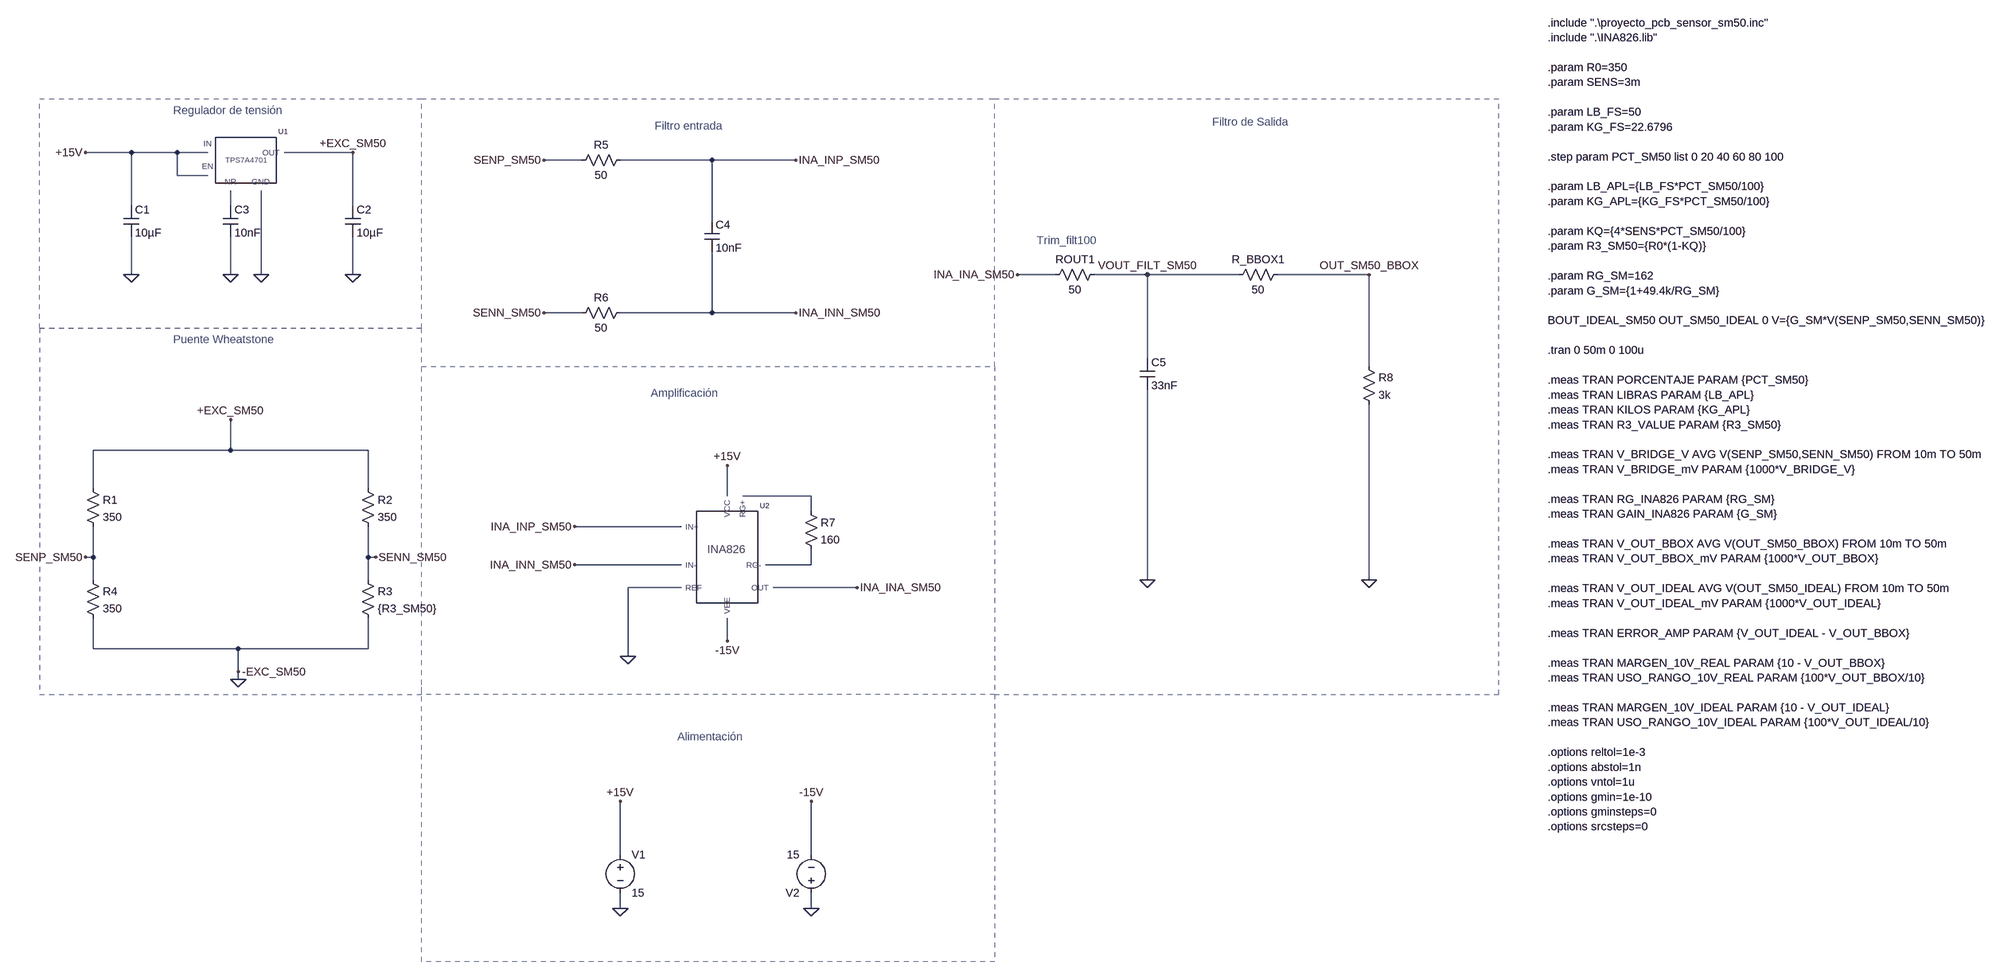
[diagram p0: schematic sensor_SM50.asc]
sensor_SM50.asc, the LTspice schematic file:
Version 4.1
SHEET 1 2144 3804
WIRE -2576 -384 -2672 -384
WIRE -2480 -384 -2576 -384
WIRE -2416 -384 -2480 -384
WIRE -2112 -384 -2256 -384
WIRE -1632 -368 -1712 -368
WIRE -1360 -368 -1552 -368
WIRE -1184 -368 -1360 -368
WIRE -2480 -336 -2480 -384
WIRE -2416 -336 -2480 -336
WIRE -2576 -272 -2576 -384
WIRE -2368 -272 -2368 -304
WIRE -2112 -272 -2112 -384
WIRE -1360 -240 -1360 -368
WIRE -2576 -128 -2576 -208
WIRE -2368 -128 -2368 -208
WIRE -2304 -128 -2304 -304
WIRE -2112 -128 -2112 -208
WIRE -640 -128 -720 -128
WIRE -448 -128 -560 -128
WIRE -256 -128 -448 -128
WIRE 16 -128 -176 -128
WIRE -1632 -48 -1712 -48
WIRE -1360 -48 -1360 -176
WIRE -1360 -48 -1552 -48
WIRE -1184 -48 -1360 -48
WIRE -448 48 -448 -128
WIRE 16 64 16 -128
WIRE -2368 240 -2368 176
WIRE -2368 240 -2656 240
WIRE -2080 240 -2368 240
WIRE -2656 320 -2656 240
WIRE -2080 320 -2080 240
WIRE -1328 336 -1328 272
WIRE -1152 336 -1296 336
WIRE -1152 368 -1152 336
WIRE -1424 400 -1648 400
WIRE -2656 464 -2656 400
WIRE -2656 464 -2672 464
WIRE -2080 464 -2080 400
WIRE -2064 464 -2080 464
WIRE -1424 480 -1648 480
WIRE -1152 480 -1152 448
WIRE -1152 480 -1248 480
WIRE -2656 512 -2656 464
WIRE -2080 512 -2080 464
WIRE -448 512 -448 112
WIRE 16 512 16 144
WIRE -1424 528 -1536 528
WIRE -1056 528 -1232 528
WIRE -1328 640 -1328 592
WIRE -2656 656 -2656 592
WIRE -2352 656 -2656 656
WIRE -2080 656 -2080 592
WIRE -2080 656 -2352 656
WIRE -1536 672 -1536 528
WIRE -2352 704 -2352 656
WIRE -2352 720 -2352 704
WIRE -1552 1088 -1552 976
WIRE -1152 1088 -1152 976
WIRE -1552 1200 -1552 1168
WIRE -1152 1200 -1152 1168
FLAG -1152 1200 0
FLAG -1552 1200 0
FLAG -1552 976 +15V
FLAG -1152 976 -15V
FLAG -2672 -384 +15V
FLAG -2576 -128 0
FLAG -2112 -128 0
FLAG -2304 -128 0
FLAG -2368 -128 0
FLAG -2112 -384 +EXC_SM50
FLAG -2368 176 +EXC_SM50
FLAG -2352 720 0
FLAG -2672 464 SENP_SM50
FLAG -2064 464 SENN_SM50
FLAG -2352 704 -EXC_SM50
FLAG -1712 -48 SENN_SM50
FLAG -1712 -368 SENP_SM50
FLAG -1184 -368 INA_INP_SM50
FLAG -1184 -48 INA_INN_SM50
FLAG -1328 640 -15V
FLAG -1328 272 +15V
FLAG -1056 528 INA_INA_SM50
FLAG -1536 672 0
FLAG -1648 480 INA_INN_SM50
FLAG -1648 400 INA_INP_SM50
FLAG -448 -128 VOUT_FILT_SM50
FLAG -448 512 0
FLAG 16 -128 OUT_SM50_BBOX
FLAG 16 512 0
FLAG -720 -128 INA_INA_SM50
SYMBOL voltage -1552 1072 R0
WINDOW 123 0 0 Left 0
SYMATTR InstName V1
SYMATTR Value 15
SYMATTR SpiceLine Rser=0.05
SYMBOL voltage -1152 1184 R180
WINDOW 123 0 0 Left 0
SYMATTR InstName V2
SYMATTR Value 15
SYMATTR SpiceLine Rser=0.05
SYMBOL cap -2592 -272 R0
SYMATTR InstName C1
SYMATTR Value 10µF
SYMBOL cap -2128 -272 R0
SYMATTR InstName C2
SYMATTR Value 10µF
SYMBOL TPS7A4701_10V -2336 -368 R0
SYMATTR InstName U1
SYMBOL cap -2384 -272 R0
SYMATTR InstName C3
SYMATTR Value 10nF
SYMBOL res -2672 304 R0
SYMATTR InstName R1
SYMATTR Value 350
SYMBOL res -2096 304 R0
SYMATTR InstName R2
SYMATTR Value 350
SYMBOL res -2096 496 R0
SYMATTR InstName R3
SYMATTR Value {R3_SM50}
SYMBOL res -2672 496 R0
SYMATTR InstName R4
SYMATTR Value 350
SYMBOL res -1536 -384 R90
WINDOW 0 0 56 VBottom 2
WINDOW 3 32 56 VTop 2
SYMATTR InstName R5
SYMATTR Value 50
SYMBOL res -1536 -64 R90
WINDOW 0 0 56 VBottom 2
WINDOW 3 32 56 VTop 2
SYMATTR InstName R6
SYMATTR Value 50
SYMBOL cap -1376 -240 R0
SYMATTR InstName C4
SYMATTR Value 10nF
SYMBOL res -1168 352 R0
SYMATTR InstName R7
SYMATTR Value 160
SYMBOL res -544 -144 R90
WINDOW 0 0 56 VBottom 2
WINDOW 3 32 56 VTop 2
SYMATTR InstName ROUT1
SYMATTR Value 50
SYMBOL cap -464 48 R0
SYMATTR InstName C5
SYMATTR Value 33nF
SYMBOL res -160 -144 R90
WINDOW 0 0 56 VBottom 2
WINDOW 3 32 56 VTop 2
SYMATTR InstName R_BBOX1
SYMATTR Value 50
SYMBOL res 0 48 R0
SYMATTR InstName R8
SYMATTR Value 3k
SYMBOL INA826 -1328 464 R0
SYMATTR InstName U2
TEXT 1192 -656 Left 2 !.include ".\\proyecto_pcb_sensor_sm50.inc"\n.include ".\\INA826.lib"\n \n.param R0=350\n.param SENS=3m\n \n.param LB_FS=50\n.param KG_FS=22.6796\n \n.step param PCT_SM50 list 0 20 40 60 80 100\n \n.param LB_APL={LB_FS*PCT_SM50/100}\n.param KG_APL={KG_FS*PCT_SM50/100}\n \n.param KQ={4*SENS*PCT_SM50/100}\n.param R3_SM50={R0*(1-KQ)}\n \n.param RG_SM=162\n.param G_SM={1+49.4k/RG_SM}\n \nBOUT_IDEAL_SM50 OUT_SM50_IDEAL 0 V={G_SM*V(SENP_SM50,SENN_SM50)}\n \n.tran 0 50m 0 100u\n \n.meas TRAN PORCENTAJE PARAM {PCT_SM50}\n.meas TRAN LIBRAS PARAM {LB_APL}\n.meas TRAN KILOS PARAM {KG_APL}\n.meas TRAN R3_VALUE PARAM {R3_SM50}\n \n.meas TRAN V_BRIDGE_V AVG V(SENP_SM50,SENN_SM50) FROM 10m TO 50m\n.meas TRAN V_BRIDGE_mV PARAM {1000*V_BRIDGE_V}\n \n.meas TRAN RG_INA826 PARAM {RG_SM}\n.meas TRAN GAIN_INA826 PARAM {G_SM}\n \n.meas TRAN V_OUT_BBOX AVG V(OUT_SM50_BBOX) FROM 10m TO 50m\n.meas TRAN V_OUT_BBOX_mV PARAM {1000*V_OUT_BBOX}\n \n.meas TRAN V_OUT_IDEAL AVG V(OUT_SM50_IDEAL) FROM 10m TO 50m\n.meas TRAN V_OUT_IDEAL_mV PARAM {1000*V_OUT_IDEAL}\n \n.meas TRAN ERROR_AMP PARAM {V_OUT_IDEAL - V_OUT_BBOX}\n \n.meas TRAN MARGEN_10V_REAL PARAM {10 - V_OUT_BBOX}\n.meas TRAN USO_RANGO_10V_REAL PARAM {100*V_OUT_BBOX/10}\n \n.meas TRAN MARGEN_10V_IDEAL PARAM {10 - V_OUT_IDEAL}\n.meas TRAN USO_RANGO_10V_IDEAL PARAM {100*V_OUT_IDEAL/10}\n \n.options reltol=1e-3\n.options abstol=1n\n.options vntol=1u\n.options gmin=1e-10\n.options gminsteps=0\n.options srcsteps=0
TEXT -1432 840 Left 2 ;Alimentación
TEXT -2488 -472 Left 2 ;Regulador de tensión
TEXT -2488 8 Left 2 ;Puente Wheatstone
TEXT -1480 -440 Left 2 ;Filtro entrada
TEXT -1488 120 Left 2 ;Amplificación
TEXT -312 -448 Left 2 ;Filtro de Salida
TEXT -680 -200 Left 2 ;Trim_filt100
LINE Normal -1968 -496 -2768 -496 4
LINE Normal -1968 -16 -1968 -496 4
LINE Normal -2768 -16 -1968 -16 2
LINE Normal -1968 -16 -2768 -16 4
LINE Normal -1968 464 -1968 -16 4
LINE Normal -2768 752 -1968 752 4
LINE Normal -2768 -16 -2768 464 4
LINE Normal -2768 464 -2768 752 4
LINE Normal -1968 752 -1968 464 4
LINE Normal -896 -496 -1968 -496 4
LINE Normal -816 -496 -896 -496 4
LINE Normal -768 -496 -816 -496 2
LINE Normal -768 64 -768 -496 4
LINE Normal -1968 64 -768 64 4
LINE Normal -768 752 -1968 752 4
LINE Normal -768 64 -768 752 4
LINE Normal 288 -496 -768 -496 2
LINE Normal 288 752 288 -496 4
LINE Normal -768 752 288 752 4
LINE Normal -1968 1312 -1968 736 4
LINE Normal -768 1312 -1968 1312 4
LINE Normal -768 752 -768 1312 4
LINE Normal -2768 -16 -2768 -496 4

The netlist it stands for:
* sensor_SM50.asc
V1 +15V 0 15 Rser=0.05
V2 0 -15V 15 Rser=0.05
C1 +15V 0 10µF
C2 +EXC_SM50 0 10µF
X§U1 +15V +15V 0 N001 +EXC_SM50 TPS7A4701_10V  ; pins IN EN GND NR OUT
C3 N001 0 10nF
R1 +EXC_SM50 SENP_SM50 350
R2 +EXC_SM50 SENN_SM50 350
R3 SENN_SM50 0 {R3_SM50}
R4 SENP_SM50 0 350
R5 INA_INP_SM50 SENP_SM50 50
R6 INA_INN_SM50 SENN_SM50 50
C4 INA_INP_SM50 INA_INN_SM50 10nF
R7 N002 N003 160
ROUT1 VOUT_FILT_SM50 INA_INA_SM50 50
C5 VOUT_FILT_SM50 0 33nF
R_BBOX1 OUT_SM50_BBOX VOUT_FILT_SM50 50
R8 OUT_SM50_BBOX 0 3k
X§U2 INA_INP_SM50 INA_INN_SM50 +15V -15V INA_INA_SM50 0 N002 N003 INA826  ; pins IN+ IN- VCC VEE OUT REF RG+ RG-
.include ".\proyecto_pcb_sensor_sm50.inc"
.include ".\INA826.lib"
.param R0=350
.param SENS=3m
.param LB_FS=50
.param KG_FS=22.6796
.step param PCT_SM50 list 0 20 40 60 80 100
.param LB_APL={LB_FS*PCT_SM50/100}
.param KG_APL={KG_FS*PCT_SM50/100}
.param KQ={4*SENS*PCT_SM50/100}
.param R3_SM50={R0*(1-KQ)}
.param RG_SM=162
.param G_SM={1+49.4k/RG_SM}
BOUT_IDEAL_SM50 OUT_SM50_IDEAL 0 V={G_SM*V(SENP_SM50,SENN_SM50)}
.tran 0 50m 0 100u
.meas TRAN PORCENTAJE PARAM {PCT_SM50}
.meas TRAN LIBRAS PARAM {LB_APL}
.meas TRAN KILOS PARAM {KG_APL}
.meas TRAN R3_VALUE PARAM {R3_SM50}
.meas TRAN V_BRIDGE_V AVG V(SENP_SM50,SENN_SM50) FROM 10m TO 50m
.meas TRAN V_BRIDGE_mV PARAM {1000*V_BRIDGE_V}
.meas TRAN RG_INA826 PARAM {RG_SM}
.meas TRAN GAIN_INA826 PARAM {G_SM}
.meas TRAN V_OUT_BBOX AVG V(OUT_SM50_BBOX) FROM 10m TO 50m
.meas TRAN V_OUT_BBOX_mV PARAM {1000*V_OUT_BBOX}
.meas TRAN V_OUT_IDEAL AVG V(OUT_SM50_IDEAL) FROM 10m TO 50m
.meas TRAN V_OUT_IDEAL_mV PARAM {1000*V_OUT_IDEAL}
.meas TRAN ERROR_AMP PARAM {V_OUT_IDEAL - V_OUT_BBOX}
.meas TRAN MARGEN_10V_REAL PARAM {10 - V_OUT_BBOX}
.meas TRAN USO_RANGO_10V_REAL PARAM {100*V_OUT_BBOX/10}
.meas TRAN MARGEN_10V_IDEAL PARAM {10 - V_OUT_IDEAL}
.meas TRAN USO_RANGO_10V_IDEAL PARAM {100*V_OUT_IDEAL/10}
.options reltol=1e-3
.options abstol=1n
.options vntol=1u
.options gmin=1e-10
.options gminsteps=0
.options srcsteps=0
* Alimentación
* Regulador de tensión
* Puente Wheatstone
* Filtro entrada
* Amplificación
* Filtro de Salida
* Trim_filt100
.backanno
.end